# Altium schematic sheet АСТА.425543.043 Э3 Лист2.SchDoc
size 426 x 301 mm; PageSetup: Record=PageOptions|CenterHorizontal=True|CenterVertical=True|PrintScale=0.94|XCorrection=1.00|YCorrection=1.00|PrintKind=1|BorderSize=5000000|LeftOffset=0|BottomOffset=0|Orientation=2|PaperLength=1000|PaperWidth=1000|Scale=100|PaperSource=7|PrintQuality=-4|MediaType=1|DitherType=10|PaperKind=A3|PrintScaleMode=1
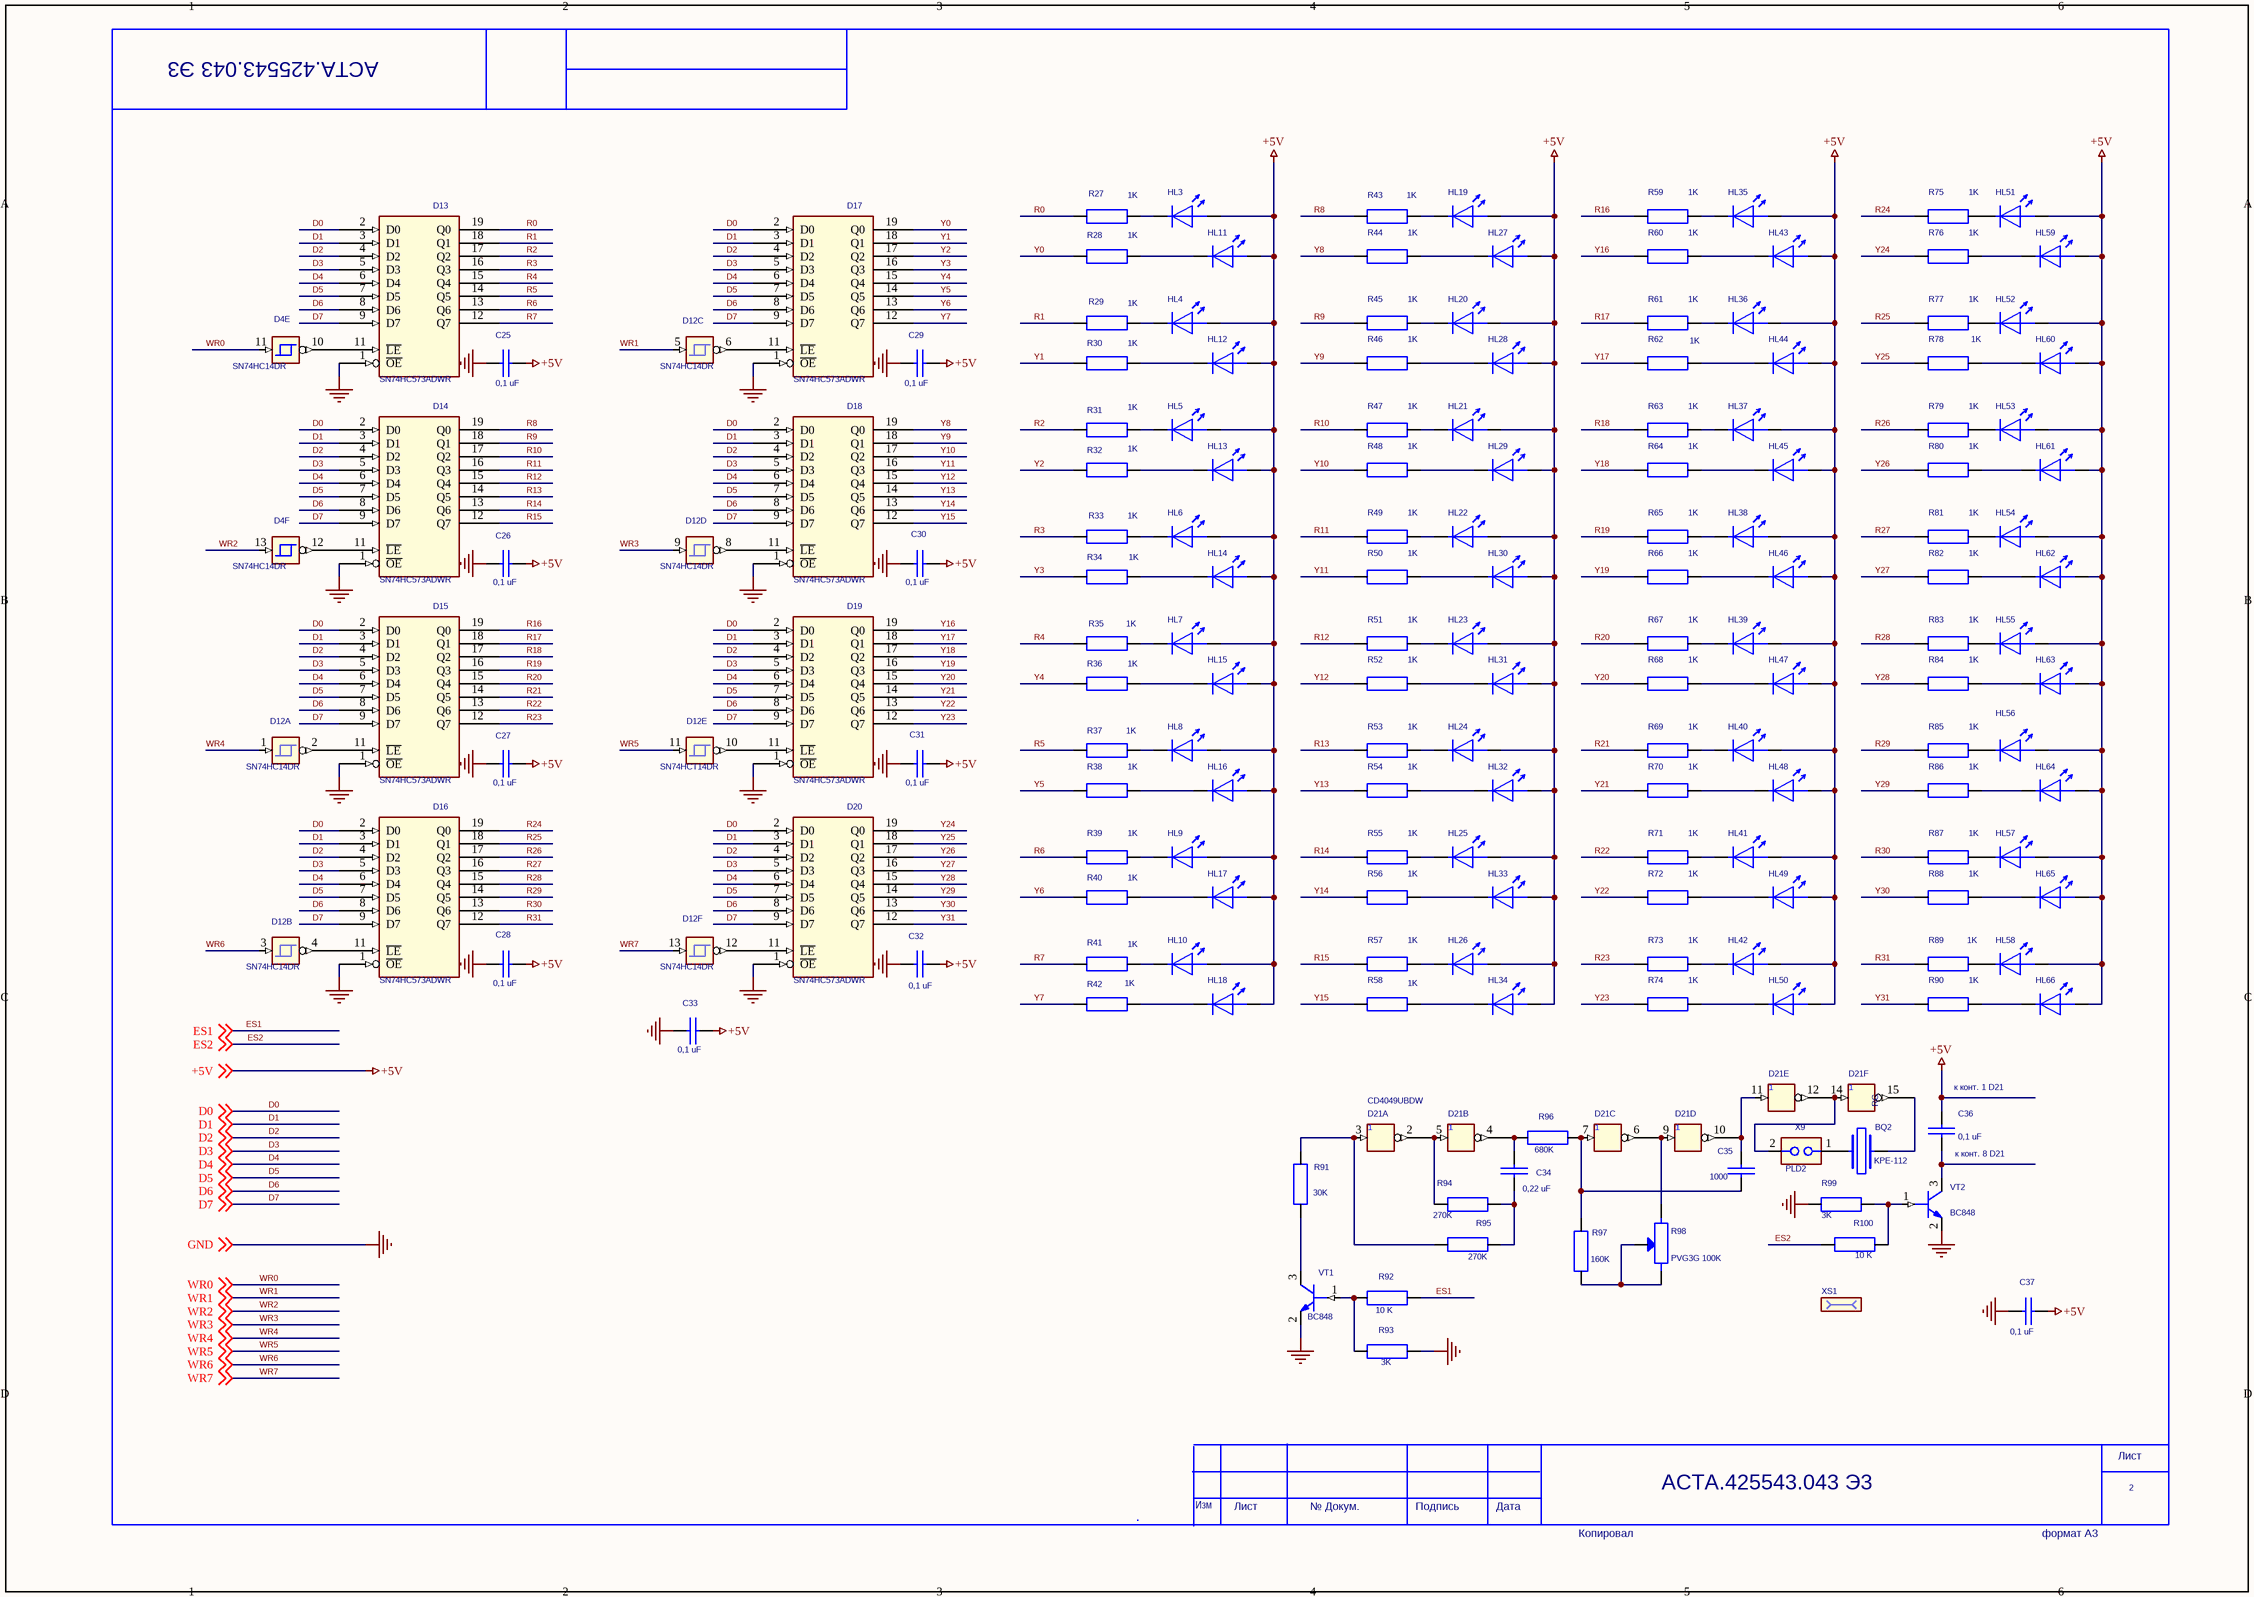
[diagram p0: АСТА.425543.043 Э3 Лист2.SchDoc]

## Parts
BQ2  KPE-112  TYP: RG  [RG05.PRT]
C25  0,1 uF  [1206.PRT]
C26  0,1 uF  [1206.PRT]
C27  0,1 uF  [1206.PRT]
C28  0,1 uF  [1206.PRT]
C29  0,1 uF  [1206.PRT]
C30  0,1 uF  [1206.PRT]
C31  0,1 uF  [1206.PRT]
C32  0,1 uF  [1206.PRT]
C33  0,1 uF  [1206.PRT]
C34  0,22 uF  [1206.PRT]
C35  1000  [1206.PRT]
C36  0,1 uF  [1206.PRT]
C37  0,1 uF  [1206.PRT]
D4  SN74HC14DR  (parts E,F of 6)
D12  SN74HC14DR  (parts A,B,C,D,E,F of 6)
D13  SN74HC573ADWR
D14  SN74HC573ADWR
D15  SN74HC573ADWR
D16  SN74HC573ADWR
D17  SN74HC573ADWR
D18  SN74HC573ADWR
D19  SN74HC573ADWR
D20  SN74HC573ADWR
D21  CD4049UBDW  (parts A,B,C,D,E,F of 6)
HL3  L-934ID-5V  (value not drawn)
HL4  L-934ID-5V  (value not drawn)
HL5  L-934ID-5V  (value not drawn)
HL6  L-934ID-5V  (value not drawn)
HL7  L-934ID-5V  (value not drawn)
HL8  L-934ID-5V  (value not drawn)
HL9  L-934ID-5V  (value not drawn)
HL10  L-934ID-5V  (value not drawn)
HL11  L-934YD-5V  (value not drawn)
HL12  L-934YD-5V  (value not drawn)
HL13  L-934YD-5V  (value not drawn)
HL14  L-934YD-5V  (value not drawn)
HL15  L-934YD-5V  (value not drawn)
HL16  L-934YD-5V  (value not drawn)
HL17  L-934YD-5V  (value not drawn)
HL18  L-934YD-5V  (value not drawn)
HL19  L-934ID-5V  (value not drawn)
HL20  L-934ID-5V  (value not drawn)
HL21  L-934ID-5V  (value not drawn)
HL22  L-934ID-5V  (value not drawn)
HL23  L-934ID-5V  (value not drawn)
HL24  L-934ID-5V  (value not drawn)
HL25  L-934ID-5V  (value not drawn)
HL26  L-934ID-5V  (value not drawn)
HL27  L-934YD-5V  (value not drawn)
HL28  L-934YD-5V  (value not drawn)
HL29  L-934YD-5V  (value not drawn)
HL30  L-934YD-5V  (value not drawn)
HL31  L-934YD-5V  (value not drawn)
HL32  L-934YD-5V  (value not drawn)
HL33  L-934YD-5V  (value not drawn)
HL34  L-934YD-5V  (value not drawn)
HL35  L-934ID-5V  (value not drawn)
HL36  L-934ID-5V  (value not drawn)
HL37  L-934ID-5V  (value not drawn)
HL38  L-934ID-5V  (value not drawn)
HL39  L-934ID-5V  (value not drawn)
HL40  L-934ID-5V  (value not drawn)
HL41  L-934ID-5V  (value not drawn)
HL42  L-934ID-5V  (value not drawn)
HL43  L-934YD-5V  (value not drawn)
HL44  L-934YD-5V  (value not drawn)
HL45  L-934YD-5V  (value not drawn)
HL46  L-934YD-5V  (value not drawn)
HL47  L-934YD-5V  (value not drawn)
HL48  L-934YD-5V  (value not drawn)
HL49  L-934YD-5V  (value not drawn)
HL50  L-934YD-5V  (value not drawn)
HL51  L-934ID-5V  (value not drawn)
HL52  L-934YD-5V  (value not drawn)
HL53  L-934ID-5V  (value not drawn)
HL54  L-934ID-5V  (value not drawn)
HL55  L-934ID-5V  (value not drawn)
HL56  L-934ID-5V  (value not drawn)
HL57  L-934ID-5V  (value not drawn)
HL58  L-934ID-5V  (value not drawn)
HL59  L-934ID-5V  (value not drawn)
HL60  L-934YD-5V  (value not drawn)
HL61  L-934YD-5V  (value not drawn)
HL62  L-934YD-5V  (value not drawn)
HL63  L-934YD-5V  (value not drawn)
HL64  L-934YD-5V  (value not drawn)
HL65  L-934YD-5V  (value not drawn)
HL66  L-934YD-5V  (value not drawn)
R27  1K  [1206.PRT]
R28  1K  [1206.PRT]
R29  1K  [1206.PRT]
R30  1K  [1206.PRT]
R31  1K  [1206.PRT]
R32  1K  [1206.PRT]
R33  1K  [1206.PRT]
R34  1K  [1206.PRT]
R35  1K  [1206.PRT]
R36  1K  [1206.PRT]
R37  1K  [1206.PRT]
R38  1K  [1206.PRT]
R39  1K  [1206.PRT]
R40  1K  [1206.PRT]
R41  1K  [1206.PRT]
R42  1K  [1206.PRT]
R43  1K  [1206.PRT]
R44  1K  [1206.PRT]
R45  1K  [1206.PRT]
R46  1K  [1206.PRT]
R47  1K  [1206.PRT]
R48  1K  [1206.PRT]
R49  1K  [1206.PRT]
R50  1K  [1206.PRT]
R51  1K  [1206.PRT]
R52  1K  [1206.PRT]
R53  1K  [1206.PRT]
R54  1K  [1206.PRT]
R55  1K  [1206.PRT]
R56  1K  [1206.PRT]
R57  1K  [1206.PRT]
R58  1K  [1206.PRT]
R59  1K  [1206.PRT]
R60  1K  [1206.PRT]
R61  1K  [1206.PRT]
R62  1K  [1206.PRT]
R63  1K  [1206.PRT]
R64  1K  [1206.PRT]
R65  1K  [1206.PRT]
R66  1K  [1206.PRT]
R67  1K  [1206.PRT]
R68  1K  [1206.PRT]
R69  1K  [1206.PRT]
R70  1K  [1206.PRT]
R71  1K  [1206.PRT]
R72  1K  [1206.PRT]
R73  1K  [1206.PRT]
R74  1K  [1206.PRT]
R75  1K  [1206.PRT]
R76  1K  [1206.PRT]
R77  1K  [1206.PRT]
R78  1K  [1206.PRT]
R79  1K  [1206.PRT]
R80  1K  [1206.PRT]
R81  1K  [1206.PRT]
R82  1K  [1206.PRT]
R83  1K  [1206.PRT]
R84  1K  [1206.PRT]
R85  1K  [1206.PRT]
R86  1K  [1206.PRT]
R87  1K  [1206.PRT]
R88  1K  [1206.PRT]
R89  1K  [1206.PRT]
R90  1K  [1206.PRT]
R91  30K  [1206.PRT]
R92  10 K  [1206.PRT]
R93  3K  [1206.PRT]
R94  270K  [1206.PRT]
R95  270K  [1206.PRT]
R96  680K  [1206.PRT]
R97  160K  [1206.PRT]
R98  PVG3G 100K
R99  3K  [1206.PRT]
R100  10 K  [1206.PRT]
VT1  BC848
VT2  BC848
X9  PLD2
XS1  EXTEND_11  (value not drawn)

## Nets
+5V: C25.2 C26.2 C27.2 C28.2 C29.2 C30.2 C31.2 C32.2 C33.2 C36.2 C37.2 HL3.1(ANODE) HL4.1(ANODE) HL5.1(ANODE) HL6.1(ANODE) HL7.1(ANODE) HL8.1(ANODE) HL9.1(ANODE) HL10.1(ANODE) HL11.1(ANODE) HL12.1(ANODE) HL13.1(ANODE) HL14.1(ANODE) HL15.1(ANODE) HL16.1(ANODE) HL17.1(ANODE) HL18.1(ANODE) HL19.1(ANODE) HL20.1(ANODE) HL21.1(ANODE) HL22.1(ANODE) HL23.1(ANODE) HL24.1(ANODE) HL25.1(ANODE) HL26.1(ANODE) HL27.1(ANODE) HL28.1(ANODE) HL29.1(ANODE) HL30.1(ANODE) HL31.1(ANODE) HL32.1(ANODE) HL33.1(ANODE) HL34.1(ANODE) HL35.1(ANODE) HL36.1(ANODE) HL37.1(ANODE) HL38.1(ANODE) HL39.1(ANODE) HL40.1(ANODE) HL41.1(ANODE) HL42.1(ANODE) HL43.1(ANODE) HL44.1(ANODE) HL45.1(ANODE) HL46.1(ANODE) HL47.1(ANODE) HL48.1(ANODE) HL49.1(ANODE) HL50.1(ANODE) HL51.1(ANODE) HL52.1(ANODE) HL53.1(ANODE) HL54.1(ANODE) HL55.1(ANODE) HL56.1(ANODE) HL57.1(ANODE) HL58.1(ANODE) HL59.1(ANODE) HL60.1(ANODE) HL61.1(ANODE) HL62.1(ANODE) HL63.1(ANODE) HL64.1(ANODE) HL65.1(ANODE) HL66.1(ANODE) ; off-sheet +5V
GND: C25.1 C26.1 C27.1 C28.1 C29.1 C30.1 C31.1 C32.1 C33.1 C37.1 D4.GND D12.7(GND) D13.1(~{OE}) D13.10(GND) D14.1(~{OE}) D14.10(GND) D15.1(~{OE}) D15.10(GND) D16.1(~{OE}) D16.10(GND) D17.1(~{OE}) D17.10(GND) D18.1(~{OE}) D18.10(GND) D19.1(~{OE}) D19.10(GND) D20.1(~{OE}) D20.10(GND) R93.2 R99.1 VT1.2(EMITTER) VT2.2(EMITTER) ; off-sheet GND
VCC: D4.VCC D12.14(VCC) D13.20(VCC) D14.20(VCC) D15.20(VCC) D16.20(VCC) D17.20(VCC) D18.20(VCC) D19.20(VCC) D20.20(VCC)
D0: D13.2(D0) D14.2(D0) D15.2(D0) D16.2(D0) D17.2(D0) D18.2(D0) D19.2(D0) D20.2(D0) ; off-sheet D0
D1: D13.3(D1) D14.3(D1) D15.3(D1) D16.3(D1) D17.3(D1) D18.3(D1) D19.3(D1) D20.3(D1) ; off-sheet D1
D2: D13.4(D2) D14.4(D2) D15.4(D2) D16.4(D2) D17.4(D2) D18.4(D2) D19.4(D2) D20.4(D2) ; off-sheet D2
D3: D13.5(D3) D14.5(D3) D15.5(D3) D16.5(D3) D17.5(D3) D18.5(D3) D19.5(D3) D20.5(D3) ; off-sheet D3
D4: D13.6(D4) D14.6(D4) D15.6(D4) D16.6(D4) D17.6(D4) D18.6(D4) D19.6(D4) D20.6(D4) ; off-sheet D4
D5: D13.7(D5) D14.7(D5) D15.7(D5) D16.7(D5) D17.7(D5) D18.7(D5) D19.7(D5) D20.7(D5) ; off-sheet D5
D6: D13.8(D6) D14.8(D6) D15.8(D6) D16.8(D6) D17.8(D6) D18.8(D6) D19.8(D6) D20.8(D6) ; off-sheet D6
D7: D13.9(D7) D14.9(D7) D15.9(D7) D16.9(D7) D17.9(D7) D18.9(D7) D19.9(D7) D20.9(D7) ; off-sheet D7
ES1: R92.1 ; off-sheet ES1
ES2: R100.2 ; off-sheet ES2
R0: D13.19(Q0) R27.1
R1: D13.18(Q1) R29.1
R2: D13.17(Q2) R31.1
R3: D13.16(Q3) R33.1
R4: D13.15(Q4) R35.1
R5: D13.14(Q5) R37.1
R6: D13.13(Q6) R39.1
R7: D13.12(Q7) R41.1
R8: D14.19(Q0) R43.1
R9: D14.18(Q1) R45.1
R10: D14.17(Q2) R47.1
R11: D14.16(Q3) R49.1
R12: D14.15(Q4) R51.1
R13: D14.14(Q5) R53.1
R14: D14.13(Q6) R55.1
R15: D14.12(Q7) R57.1
R16: D15.19(Q0) R59.1
R17: D15.18(Q1) R61.1
R18: D15.17(Q2) R63.1
R19: D15.16(Q3) R65.1
R20: D15.15(Q4) R67.1
R21: D15.14(Q5) R69.1
R22: D15.13(Q6) R71.1
R23: D15.12(Q7) R73.1
R24: D16.19(Q0) R75.1
R25: D16.18(Q1) R77.1
R26: D16.17(Q2) R79.1
R27: D16.16(Q3) R81.1
R28: D16.15(Q4) R83.1
R29: D16.14(Q5) R85.1
R30: D16.13(Q6) R87.1
R31: D16.12(Q7) R89.1
WR0: D4.11(I) ; off-sheet WR0
WR1: D12.5(A) ; off-sheet WR1
WR2: D4.13(I) ; off-sheet WR2
WR3: D12.9(A) ; off-sheet WR3
WR4: D12.1(A) ; off-sheet WR4
WR5: D12.11(A) ; off-sheet WR5
WR6: D12.3(A) ; off-sheet WR6
WR7: D12.13(A) ; off-sheet WR7
Y0: D17.19(Q0) R28.1
Y1: D17.18(Q1) R30.1
Y2: D17.17(Q2) R32.1
Y3: D17.16(Q3) R34.1
Y4: D17.15(Q4) R36.1
Y5: D17.14(Q5) R38.1
Y6: D17.13(Q6) R40.1
Y7: D17.12(Q7) R42.1
Y8: D18.19(Q0) R44.1
Y9: D18.18(Q1) R46.1
Y10: D18.17(Q2) R48.1
Y11: D18.16(Q3) R50.1
Y12: D18.15(Q4) R52.1
Y13: D18.14(Q5) R54.1
Y14: D18.13(Q6) R56.1
Y15: D18.12(Q7) R58.1
Y16: D19.19(Q0) R60.1
Y17: D19.18(Q1) R62.1
Y18: D19.17(Q2) R64.1
Y19: D19.16(Q3) R66.1
Y20: D19.15(Q4) R68.1
Y21: D19.14(Q5) R70.1
Y22: D19.13(Q6) R72.1
Y23: D19.12(Q7) R74.1
Y24: D20.19(Q0) R76.1
Y25: D20.18(Q1) R78.1
Y26: D20.17(Q2) R80.1
Y27: D20.16(Q3) R82.1
Y28: D20.15(Q4) R84.1
Y29: D20.14(Q5) R86.1
Y30: D20.13(Q6) R88.1
Y31: D20.12(Q7) R90.1
NetBQ2_1: BQ2.1 X9.1
NetBQ2_2: BQ2.2 D21.15(O)
NetC34_1: C34.1 R94.1 R95.1
NetC34_2: C34.2 D21.4(O) R96.2
NetC35_1: C35.1 D21.7(I) R96.1 R97.1
NetC35_2: C35.2 D21.10(O) D21.11(I)
NetC36_1: C36.1 VT2.3(COLLECTOR)
NetD4_10: D4.10(O) D13.11(~{LE})
NetD4_12: D4.12(O) D14.11(~{LE})
NetD12_2: D12.2(Y) D15.11(~{LE})
NetD12_4: D12.4(Y) D16.11(~{LE})
NetD12_6: D12.6(Y) D17.11(~{LE})
NetD12_8: D12.8(Y) D18.11(~{LE})
NetD12_10: D12.10(Y) D19.11(~{LE})
NetD12_12: D12.12(Y) D20.11(~{LE})
NetD21_2: D21.2(O) D21.5(I) R94.2
NetD21_3: D21.3(I) R91.2 R95.2
NetD21_6: D21.6(O) D21.9(I) R98.B
NetD21_12: D21.12(O) D21.14(I) X9.2
NetHL3_2: HL3.2(CATHODE) R27.2
NetHL4_2: HL4.2(CATHODE) R29.2
NetHL5_2: HL5.2(CATHODE) R31.2
NetHL6_2: HL6.2(CATHODE) R33.2
NetHL7_2: HL7.2(CATHODE) R35.2
NetHL8_2: HL8.2(CATHODE) R37.2
NetHL9_2: HL9.2(CATHODE) R39.2
NetHL10_2: HL10.2(CATHODE) R41.2
NetHL11_2: HL11.2(CATHODE) R28.2
NetHL12_2: HL12.2(CATHODE) R30.2
NetHL13_2: HL13.2(CATHODE) R32.2
NetHL14_2: HL14.2(CATHODE) R34.2
NetHL15_2: HL15.2(CATHODE) R36.2
NetHL16_2: HL16.2(CATHODE) R38.2
NetHL17_2: HL17.2(CATHODE) R40.2
NetHL18_2: HL18.2(CATHODE) R42.2
NetHL19_2: HL19.2(CATHODE) R43.2
NetHL20_2: HL20.2(CATHODE) R45.2
NetHL21_2: HL21.2(CATHODE) R47.2
NetHL22_2: HL22.2(CATHODE) R49.2
NetHL23_2: HL23.2(CATHODE) R51.2
NetHL24_2: HL24.2(CATHODE) R53.2
NetHL25_2: HL25.2(CATHODE) R55.2
NetHL26_2: HL26.2(CATHODE) R57.2
NetHL27_2: HL27.2(CATHODE) R44.2
NetHL28_2: HL28.2(CATHODE) R46.2
NetHL29_2: HL29.2(CATHODE) R48.2
NetHL30_2: HL30.2(CATHODE) R50.2
NetHL31_2: HL31.2(CATHODE) R52.2
NetHL32_2: HL32.2(CATHODE) R54.2
NetHL33_2: HL33.2(CATHODE) R56.2
NetHL34_2: HL34.2(CATHODE) R58.2
NetHL35_2: HL35.2(CATHODE) R59.2
NetHL36_2: HL36.2(CATHODE) R61.2
NetHL37_2: HL37.2(CATHODE) R63.2
NetHL38_2: HL38.2(CATHODE) R65.2
NetHL39_2: HL39.2(CATHODE) R67.2
NetHL40_2: HL40.2(CATHODE) R69.2
NetHL41_2: HL41.2(CATHODE) R71.2
NetHL42_2: HL42.2(CATHODE) R73.2
NetHL43_2: HL43.2(CATHODE) R60.2
NetHL44_2: HL44.2(CATHODE) R62.2
NetHL45_2: HL45.2(CATHODE) R64.2
NetHL46_2: HL46.2(CATHODE) R66.2
NetHL47_2: HL47.2(CATHODE) R68.2
NetHL48_2: HL48.2(CATHODE) R70.2
NetHL49_2: HL49.2(CATHODE) R72.2
NetHL50_2: HL50.2(CATHODE) R74.2
NetHL51_2: HL51.2(CATHODE) R75.2
NetHL52_2: HL52.2(CATHODE) R77.2
NetHL53_2: HL53.2(CATHODE) R79.2
NetHL54_2: HL54.2(CATHODE) R81.2
NetHL55_2: HL55.2(CATHODE) R83.2
NetHL56_2: HL56.2(CATHODE) R85.2
NetHL57_2: HL57.2(CATHODE) R87.2
NetHL58_2: HL58.2(CATHODE) R89.2
NetHL59_2: HL59.2(CATHODE) R76.2
NetHL60_2: HL60.2(CATHODE) R78.2
NetHL61_2: HL61.2(CATHODE) R80.2
NetHL62_2: HL62.2(CATHODE) R82.2
NetHL63_2: HL63.2(CATHODE) R84.2
NetHL64_2: HL64.2(CATHODE) R86.2
NetHL65_2: HL65.2(CATHODE) R88.2
NetHL66_2: HL66.2(CATHODE) R90.2
NetR91_1: R91.1 VT1.3(COLLECTOR)
NetR92_2: R92.2 R93.1 VT1.1(BASE)
NetR97_2: R97.2 R98.A R98.WIPER
NetR99_2: R99.2 R100.1 VT2.1(BASE)

## Notes on the sheet
- АСТА.425543.043 Э3
- (near C36) к конт. 1 D21
- (near C36) к конт. 8 D21
- Лист
- Изм
- № Докум.
- Подпись
- Дата
- Копировал
- формат А3
- 2
- (in symbol 4049_0, part A) 1
- (in symbol 4049_0, part B) 1
- (in symbol 4049_0, part C) 1
- (in symbol 4049_0, part D) 1
- (in symbol 4049_0, part E) 1
- (in symbol 4049_0, part F) 1

## Library data of the parts
BQ2 = QUARTZ: Specif: PK; TR: -; PRT: -; PAK: -; PC: -; NOTE: -; U: -
C25-C35 C37 = CHIP-C: Specif: SMD NP0 50V 15pF  10%  0805
C36 = CHIP-C: Specif: SMD X7R 50V 0,1uF  5% 0805
D4 = 14069_5
D12 = 74HC14_1
D13 D15 D16 D18-D20 = 74HC573_0
D14 = 74HC573_5
D17 = 74HC573_6
D21 = 4049_0
HL3-HL66 = AL307AM
R27-R97 R99 R100 = CHIP-R: Specif: RC 11 SMD 5%
R98 = RESISTOR VAR_1
VT1 VT2 = NPN CBE_0
X9 = EXTEND_22_Dup1